# Altium schematic sheet VUE_PIC32_v1_0_Motor_2A.SchDoc: [VUE32 - 2A H-Bridge motor driver]
size A4; Engineer: JFDuval; Revision: 1.0
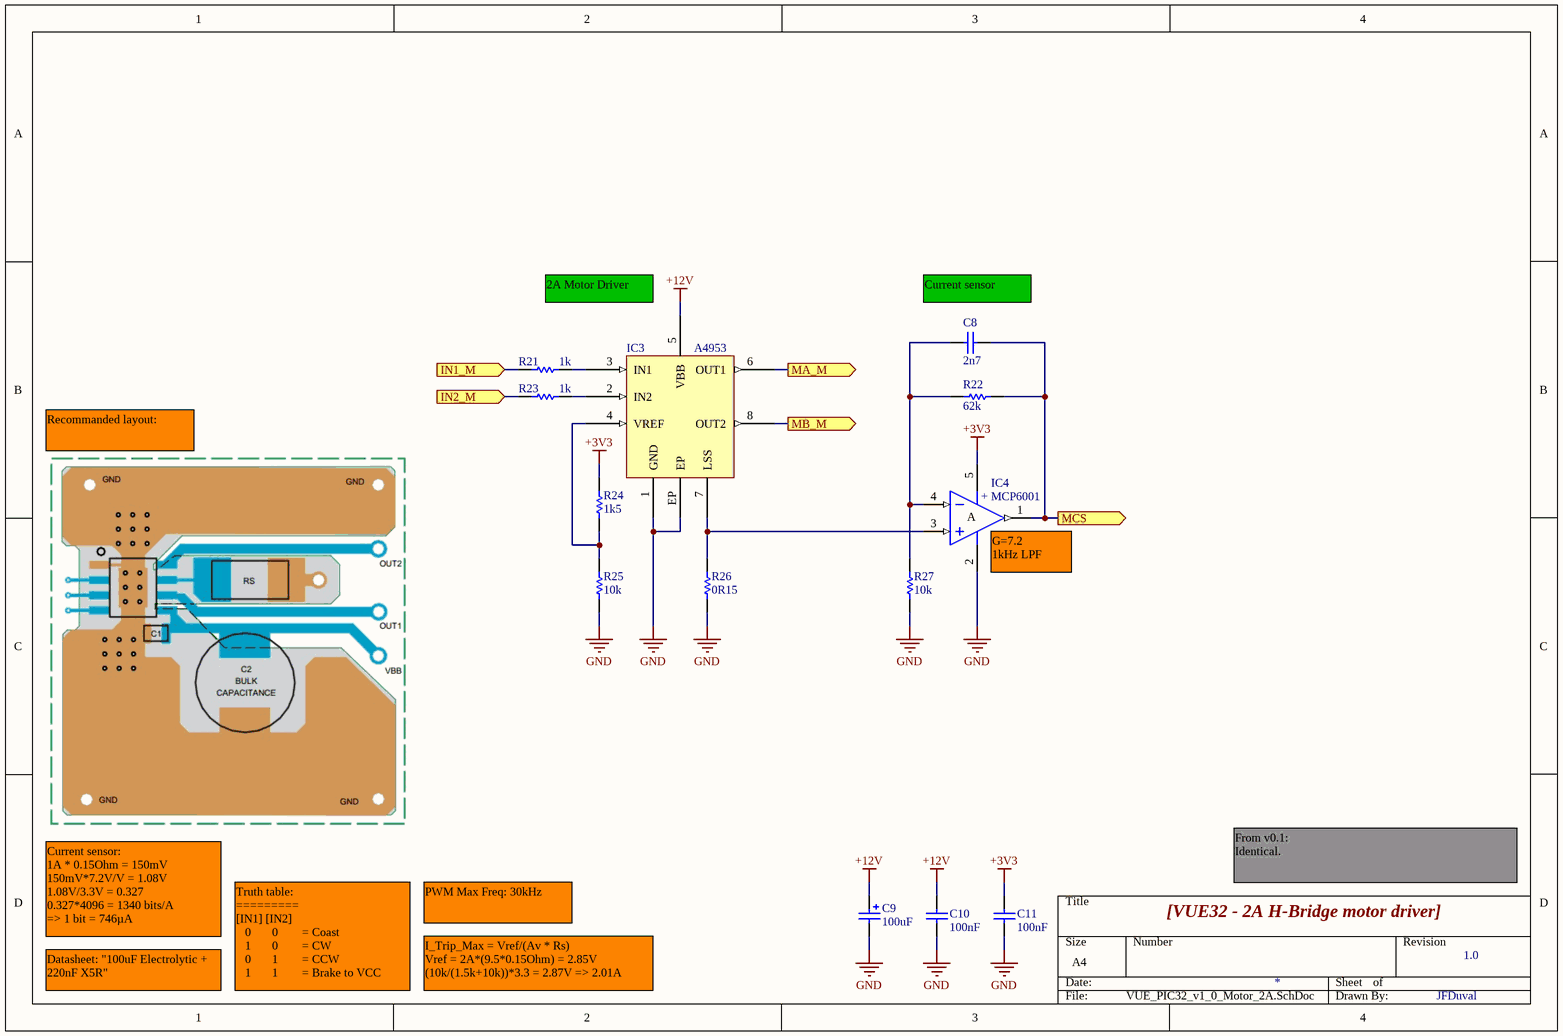
[diagram p0: VUE_PIC32_v1_0_Motor_2A.SchDoc]

## Parts
C8  2n7  [0402C]
C9  100uF  [CAP_PANA_D_D8]
C10  100nF  [0402C]
C11  100nF  [0402C]
IC3  A4953  [SOIC-8_PAD]
IC4  MCP6001  [SC70-5]
R21  1k  [0402]
R22  62k  [0402]
R23  1k  [0402]
R24  1k5  [0402]
R25  10k  [0402]
R26  0R15  [2512]
R27  10k  [0402]

## Ports
IN1_M (in), IN2_M (in), MA_M (out), MB_M (out), MCS (out)

## Nets
+3V3: C11.2 IC4.5(VDD) R24.2
+12V: C9.A C10.2 IC3.5(VBB)
GND: C9.K C10.1 C11.1 IC3.1(GND) IC3.EP IC4.2(VSS) R25.1 R26.1 R27.1
IN1_M: R21.1 ; port IN1_M
IN2_M: R23.1 ; port IN2_M
MA_M: IC3.6(OUT1) ; port MA_M
MB_M: IC3.8(OUT2) ; port MB_M
MCS: C8.2 IC4.1(OUT) R22.1 ; port MCS
NetC8_1: C8.1 IC4.4(IN-) R22.2 R27.2
NetIC3_2: IC3.2(IN2) R23.2
NetIC3_3: IC3.3(IN1) R21.2
NetIC3_4: IC3.4(VREF) R24.1 R25.2
NetIC3_7: IC3.7(LSS) IC4.3(IN+) R26.2

## Notes on the sheet
- 2A Motor Driver
- (near C8) Current sensor
- Recommanded layout:
- (near IC4) G=7.2
  1kHz LPF
- PWM Max Freq: 30kHz
- From v0.1:
  Identical.
- Datasheet: "100uF Electrolytic + 220nF X5R"
- Current sensor:
  1A * 0.15Ohm = 150mV
  150mV*7.2V/V = 1.08V
  1.08V/3.3V = 0.327
  0.327*4096 = 1340 bits/A
  => 1 bit = 746µA
- Truth table:
  =========
  [IN1] [IN2]
  0       0        = Coast
  1       0        = CW
  0       1        = CCW
  1       1        = Brake to VCC
- I_Trip_Max = Vref/(Av * Rs)
  Vref = 2A*(9.5*0.15Ohm) = 2.85V
  (10k/(1.5k+10k))*3.3 = 2.87V => 2.01A
- (in symbol IC_OPA_MICROCHIP_MCP6001_SINGLE_SC70-5) +; A

## Library data of the parts
C8 = CAP_TDK_C_0402_2n7F_10V: CAP CER 2700PF 10V 5% SL 0402; MfgPartNumber: C1005SL1A272J; Mfg: TDK; Digikey: 445-2661-1-ND; Value: 2n7
C9 = CAP_PANASONIC_100UF_25V: CAP ALUM 100UF 25V 20% SMD; MfgPartNumber: EEE-FK1E101XP; Mfg: Panasonic - ECG; Digikey: PCE3797CT-ND; Value: 100uF
C10 C11 = CAP_TDK_C_0402_100nF_25V: CAP CER 0.1UF 25V Y5V 0402; MfgPartNumber: C1005Y5V1E104Z; Mfg: TDK; Value: 100nF; Digikey: 445-3445-1-ND
IC3 = IC_ALLEGRO_A4953_MOTOR_HBRIDGE_40V_2A_SOIC8: IC PWM MOTOR DVR FULL 8SOIC; MfgPartNumber: A4953ELJTR-T; Mfg: Allegro Microsystems Inc; Value: A4953; Digikey: 620-1428-1-ND
IC4 = IC_OPA_MICROCHIP_MCP6001_SINGLE_SC70-5: IC OPAMP 1.8V 1MHZ SINGLE SC70-5; MfgPartNumber: MCP6001T-I/LT; Mfg: Microchip Technology; Value: MCP6001; Digikey: MCP6001T-I/LTCT-ND
R21 R23 = RES_YAGEO_0402_1K_1PCT: RES 1.00K OHM 1/16W 1% 0402 SMD; MfgPartNumber: RC0402FR-071KL; Mfg: Yageo; Digikey: 311-1.00KLRCT-ND; Value: 1k
R22 = RES_YAGEO_0402_62K_1PCT: RES 62.0K OHM 1/16W 1% 0402 SMD; MfgPartNumber: RC0402FR-0762KL; Mfg: Yageo; Digikey: 311-62.0KLRCT-ND; Value: 62k
R24 = RES_YAGEO_0402_1K5_1PCT: RES 1.50K OHM 1/16W 1% 0402 SMD; MfgPartNumber: RC0402FR-071K5L; Mfg: Yageo; Digikey: 311-1.50KLRCT-ND; Value: 1k5
R25 R27 = RES_YAGEO_0402_10K_1PCT: RES 10.0K OHM 1/16W 1% 0402 SMD; MfgPartNumber: RC0402FR-0710KL; Mfg: Yageo; Digikey: 311-10.0KLRCT-ND; Value: 10k
R26 = RES_TT_2512_0R15_1PCT_2W_CURRENT_SENSE: RES .150 OHM 2W 1% 2512 SMD; MfgPartNumber: LRC-LR2512LF-01-R150-F; Mfg: TT Electronics/IRC; Digikey: 989-1064-1-ND; Value: 0R15